# Altium project PCB_Project1.PrjPCB
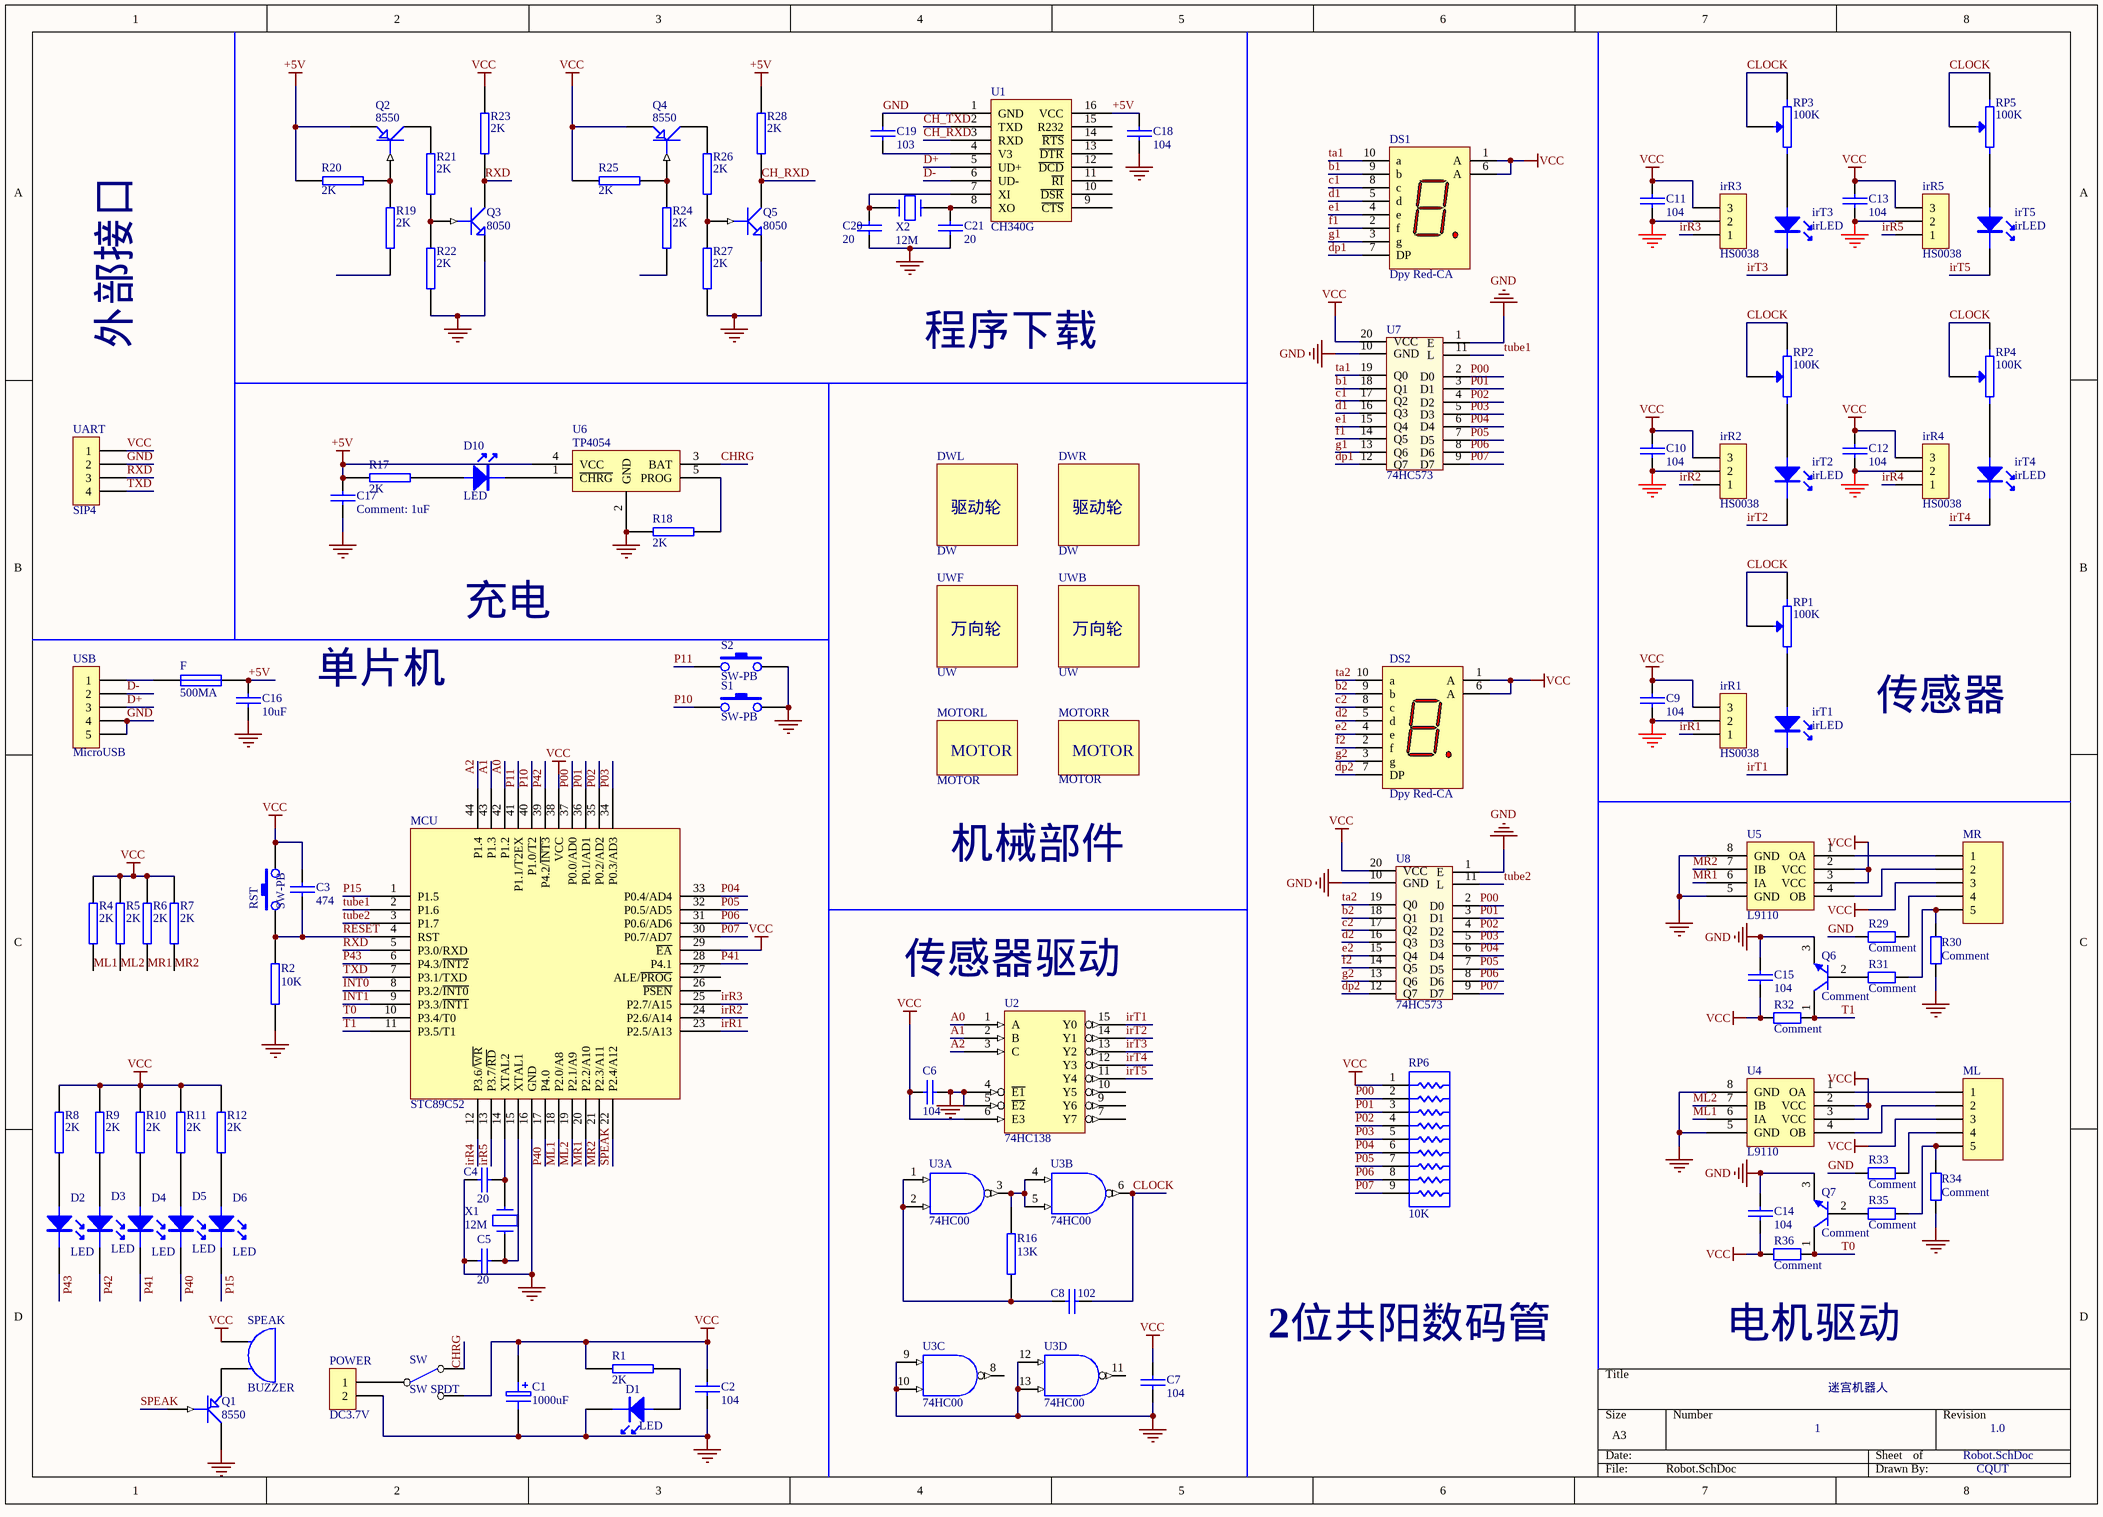
[diagram p0: Robot.SchDoc]
1 sheet, 113 parts. Net scope: global (net labels, ports and power ports of the same name join across sheets).
Board file: Robot.PcbDoc

## Sheet Robot.SchDoc: 迷宫机器人
size A3; Organization: CQUT; Address1: 中国重庆市巴南区红光大道69号重庆理工大学; DocumentNumber: 1; Revision: 1.0; SheetNumber: 1; SheetTotal: 1

### Parts
C1  1000uF  [RB.1/.3]
C2  104  [0805C]
C3  474  [0805C]
C4  20  [0805C]
C5  20  [0805C]
C6  104  [0805C]
C7  104  [0805C]
C8  102  [0805C]
C9  104  [0805C]
C10  104  [0805C]
C11  104  [0805C]
C12  104  [0805C]
C13  104  [0805C]
C14  104  [0805C]
C15  104  [0805C]
C16  10uF  [0805C]
C17  1uF  [0805C]
C18  104  [0805C]
C19  103  [0805C]
C20  20  [0805C]
C21  20  [0805C]
D1  LED  [0805D]
D2  LED  [0805D]
D3  LED  [0805D]
D4  LED  [0805D]
D5  LED  [0805D]
D6  LED  [0805D]
D10  LED  [0805D]
DS1  Dpy Red-CA  [A]
DS2  Dpy Red-CA  [A]
DWL  DW  [DW]
DWR  DW  [DW]
F  500MA  [0805R]
irR1  HS0038  [SIP3]
irR2  HS0038  [SIP3]
irR3  HS0038  [SIP3]
irR4  HS0038  [SIP3]
irR5  HS0038  [SIP3]
irT1  irLED  [LED-5-TOP]
irT2  irLED  [LED-5-TOP]
irT3  irLED  [LED-5-TOP]
irT4  irLED  [LED-5-TOP]
irT5  irLED  [LED-5-TOP]
MCU  STC89C52  [TQFP-44]
ML  Comment  (value not drawn)
MOTORL  MOTOR  [MOTOR]
MOTORR  MOTOR  [MOTOR]
MR  Comment  (value not drawn)
POWER  DC3.7V  [XH2.54-2P]
Q1  8550  [SOT-23-P]
Q2  8550  [SOT-23-P]
Q3  8050  [SOT-23-N]
Q4  8550  [SOT-23-P]
Q5  8050  [SOT-23-N]
Q6  Comment
Q7  Comment
R1  2K  [0805R]
R2  10K  [0805R]
R4  2K  [0805R]
R5  2K  [0805R]
R6  2K  [0805R]
R7  2K  [0805R]
R8  2K  [0805R]
R9  2K  [0805R]
R10  2K  [0805R]
R11  2K  [0805R]
R12  2K  [0805R]
R16  13K  [0805R]
R17  2K  [0805R]
R18  2K  [0805R]
R19  2K  [0805R]
R20  2K  [0805R]
R21  2K  [0805R]
R22  2K  [0805R]
R23  2K  [0805R]
R24  2K  [0805R]
R25  2K  [0805R]
R26  2K  [0805R]
R27  2K  [0805R]
R28  2K  [0805R]
R29  Comment  [0805R]
R30  Comment  [0805R]
R31  Comment  [0805R]
R32  Comment  [0805R]
R33  Comment  [0805R]
R34  Comment  [0805R]
R35  Comment  [0805R]
R36  Comment  [0805R]
RP1  100K  [VR-5]
RP2  100K  [VR-5]
RP3  100K  [VR-5]
RP4  100K  [VR-5]
RP5  100K  [VR-5]
RP6  10K  [SIP9 - duplicate]
RST  SW-PB  [SWITCH]
S1  SW-PB  [SWITCH]
S2  SW-PB  [SWITCH]
SPEAK  BUZZER  [BUZZ]
SW  SW SPDT  [SW-1-2]
U1  CH340G  [SOP-16]
U2  74HC138  [SOP-16]
U3  74HC00  [SO-14]  (parts A,B,C,D of 4)
U4  L9110  [SO-8]
U5  L9110  [SO-8]
U6  TP4054  [SOT-23-5]
U7  74HC573  [SOP-20（1.27）]
U8  74HC573  [SOP-20（1.27）]
UART  SIP4  [SIP4]
USB  MicroUSB  [MircoUSB]
UWB  UW  [UW]
UWF  UW  [UW]
X1  12M  [XTAL2]
X2  12M  [XTAL2]

### Nets
+5V: C16.1 C17.1 C18.1 F.2 Q2.2(E) R17.1 R20.1 R28.1 U1.16(VCC) U6.4(VCC)
GND: C1.2 C2.2 C4.2 C5.2 C6.1 C7.2 C9.2 C10.2 C11.2 C12.2 C13.2 C14.2 C15.2 C16.2 C17.2 C18.2 C19.1 C20.2 C21.2 D1.2 irR1.2 irR2.2 irR3.2 irR4.2 irR5.2 MCU.16(GND) POWER.2 Q1.3(C) Q3.3(E) Q5.3(E) Q6.3(E) Q7.3(E) R2.1 R18.1 R22.2 R27.2 R29.2 R30.1 R33.2 R34.1 S1.2 S2.2 U1.1(GND) U2.4(~{E1}) U2.5(~{E2}) U2.8(GND) U3.7(GND) U3.9(A) U3.10(B) U3.12(A) U3.13(B) U4.5(GND) U4.8(GND) U5.5(GND) U5.8(GND) U6.2(GND) U7.1(E) U7.10(GND) U8.1(E) U8.10(GND) UART.2 USB.4 USB.5
VCC: C1.1 C2.1 C3.1 C6.2 C7.1 C9.1 C10.1 C11.1 C12.1 C13.1 C14.1 C15.1 DS1.1(A) DS1.6(A) DS2.1(A) DS2.6(A) irR1.3 irR2.3 irR3.3 irR4.3 irR5.3 MCU.29(~{EA}) MCU.38(VCC) ML.3 MR.3 Q4.2(E) R1.1 R4.1 R5.1 R6.1 R7.1 R8.1 R9.1 R10.1 R11.1 R12.1 R23.1 R25.1 R32.1 R36.1 RP6.1 RST.2 SPEAK.1(A) SW.3(NO) U2.6(E3) U2.16(VCC) U3.14(VCC) U4.2(VCC) U4.3(VCC) U5.2(VCC) U5.3(VCC) U7.20(VCC) U8.20(VCC) UART.1
A0: MCU.42(P1.2) U2.1(A)
A1: MCU.43(P1.3) U2.2(B)
A2: MCU.44(P1.4) U2.3(C)
b1: DS1.9(b) U7.18(Q1)
b2: DS2.9(b) U8.18(Q1)
c1: DS1.8(c) U7.17(Q2)
c2: DS2.8(c) U8.17(Q2)
CH_RXD: Q5.2(C) R28.2 U1.3(RXD)
CH_TXD: U1.2(TXD)
CHRG: SW.2(NC) U6.3(BAT)
CLOCK: C8.1 RP1.1 RP1.2(W) RP2.1 RP2.2(W) RP3.1 RP3.2(W) RP4.1 RP4.2(W) RP5.1 RP5.2(W) U3.6(Y)
d1: DS1.5(d) U7.16(Q3)
d2: DS2.5(d) U8.16(Q3)
D+: U1.5(UD+) USB.3
D-: U1.6(UD-) USB.2
dp1: DS1.7(DP) U7.12(Q7)
dp2: DS2.7(DP) U8.12(Q7)
e1: DS1.4(e) U7.15(Q4)
e2: DS2.4(e) U8.15(Q4)
f1: DS1.2(f) U7.14(Q5)
f2: DS2.2(f) U8.14(Q5)
g1: DS1.3(g) U7.13(Q6)
g2: DS2.3(g) U8.13(Q6)
INT0: MCU.8(P3.2/~{INT0})
INT1: MCU.9(P3.3/~{INT1})
irR1: irR1.1 MCU.23(P2.5/A13)
irR2: irR2.1 MCU.24(P2.6/A14)
irR3: irR3.1 MCU.25(P2.7/A15)
irR4: irR4.1 MCU.12(P3.6/~{WR})
irR5: irR5.1 MCU.13(P3.7/~{RD})
irT1: irT1.2 U2.15(Y0)
irT2: irT2.2 U2.14(Y1)
irT3: irT3.2 U2.13(Y2)
irT4: irT4.2 U2.12(Y3)
irT5: irT5.2 U2.11(Y4)
ML1: MCU.18(P2.0/A8) R4.2 U4.6(IA)
ML2: MCU.19(P2.1/A9) R5.2 U4.7(IB)
MR1: MCU.20(P2.2/A10) R6.2 U5.6(IA)
MR2: MCU.21(P2.3/A11) R7.2 U5.7(IB)
P00: MCU.37(P0.0/AD0) RP6.2 U7.2(D0) U8.2(D0)
P01: MCU.36(P0.1/AD1) RP6.3 U7.3(D1) U8.3(D1)
P02: MCU.35(P0.2/AD2) RP6.4 U7.4(D2) U8.4(D2)
P03: MCU.34(P0.3/AD3) RP6.5 U7.5(D3) U8.5(D3)
P04: MCU.33(P0.4/AD4) RP6.6 U7.6(D4) U8.6(D4)
P05: MCU.32(P0.5/AD5) RP6.7 U7.7(D5) U8.7(D5)
P06: MCU.31(P0.6/AD6) RP6.8 U7.8(D6) U8.8(D6)
P07: MCU.30(P0.7/AD7) RP6.9 U7.9(D7) U8.9(D7)
P10: MCU.40(P1.0/T2) S1.1
P11: MCU.41(P1.1/T2EX) S2.1
P15: D6.2 MCU.1(P1.5)
P40: D5.2 MCU.17(P4.0)
P41: D4.2 MCU.28(P4.1)
P42: D3.2 MCU.39(P4.2/~{INT3})
P43: D2.2 MCU.6(P4.3/~{INT2})
RESET: C3.2 MCU.4(RST) R2.2 RST.1
RXD: MCU.5(P3.0/RXD) Q3.2(C) R23.2 UART.3
SPEAK: MCU.22(P2.4/A12) Q1.1(B)
T0: MCU.10(P3.4/T0) Q7.1(C) R36.2
T1: MCU.11(P3.5/T1) Q6.1(C) R32.2
ta1: DS1.10(a) U7.19(Q0)
ta2: DS2.10(a) U8.19(Q0)
tube1: MCU.2(P1.6) U7.11(L)
tube2: MCU.3(P1.7) U8.11(L)
TXD: MCU.7(P3.1/TXD) UART.4
NetC4_1: C4.1 MCU.14(XTAL2) X1.2
NetC5_1: C5.1 MCU.15(XTAL1) X1.1
NetC8_2: C8.2 R16.1 U3.1(A) U3.2(B)
NetC19_2: C19.2 U1.4(V3)
NetC20_1: C20.1 U1.7(XI) X2.1
NetC21_1: C21.1 U1.8(XO) X2.2
NetD1_1: D1.1 R1.2
NetD2_1: D2.1 R8.2
NetD3_1: D3.1 R9.2
NetD4_1: D4.1 R10.2
NetD5_1: D5.1 R11.2
NetD6_1: D6.1 R12.2
NetD10_1: D10.1 R17.2
NetD10_2: D10.2 U6.1(~{CHRG})
NetF_1: F.1 USB.1
NetirT1_1: irT1.1 RP1.3
NetirT2_1: irT2.1 RP2.3
NetirT3_1: irT3.1 RP3.3
NetirT4_1: irT4.1 RP4.3
NetirT5_1: irT5.1 RP5.3
NetML_1: ML.1 U4.1(OA)
NetML_2: ML.2 U4.4(OB)
NetML_4: ML.4 R33.1
NetML_5: ML.5 R34.2 R35.1
NetMR_1: MR.1 U5.1(OA)
NetMR_2: MR.2 U5.4(OB)
NetMR_4: MR.4 R29.1
NetMR_5: MR.5 R30.2 R31.1
NetPOWER_1: POWER.1 SW.1(COMMON)
NetQ1_2: Q1.2(E) SPEAK.2(B)
NetQ2_1: Q2.1(B) R19.1 R20.2
NetQ2_3: Q2.3(C) R21.1
NetQ3_1: Q3.1(B) R21.2 R22.1
NetQ4_1: Q4.1(B) R24.1 R25.2
NetQ4_3: Q4.3(C) R26.1
NetQ5_1: Q5.1(B) R26.2 R27.1
NetQ6_2: Q6.2(B) R31.2
NetQ7_2: Q7.2(B) R35.2
NetR16_2: R16.2 U3.3(Y) U3.4(A) U3.5(B)
NetR18_2: R18.2 U6.5(PROG)

Not connected (* = marked no-connect by the designer): MCU 26(~{PSEN}) 27(ALE/~{PROG}); R19 2; R24 2; U1 9(~{CTS}) 10(~{DSR}) 11(~{RI}) 12(~{DCD}) 13(~{DTR}) 14(~{RTS}) 15(R232); U2 7(Y7) 9(Y6) 10(Y5); U3 8(Y) 11(Y)

### Notes on the sheet
- 外部接口
- 程序下载
- 充电
- 单片机
- 传感器
- 机械部件
- (near U2) 传感器驱动
- (near R36) 电机驱动
- Labels drawn without touching a wire or pin: 2位共阳数码管
- (in symbol DW) 驱动轮
- (in symbol UW) 万向轮

### Library data of the parts
C1 = ELECTRO1: Electrolytic Capacitor
C2-C21 = CAP: Capacitor
DS1 DS2 = Dpy Red-CA: 7.62 mm Black Surface HER 7-Segment Display: CA, RH DP; MinimumIntensity: 360 ucd; Note: IF = 5 mA; Colour: High Efficiency Red (HER); Note: Pins 1 and 6 are redundant Anodes.; Published: 8-Jun-2000; LatestRevisionDate: 17-Dec-2003; LatestRevisionNote: Schematic revised, PCB Footprint replaced.; DatasheetVersion: 19-Feb-2002; PackageVersion: 11-Feb-2002; PackageReference: A; Publisher: Altium Limited; PackageDescription: LED, 7-Segment Display, 7.62 mm, RHD; 10 Leads; Row Space 5.08 mm; Pitch 2.54 mm; ComponentLink1Description: Manufacturer Link; ComponentLink1URL: http://www.agilent.com/
DWL DWR = DW: driving wheel
F = FUSE1: Fuse
irR1-irR5 = CON3: Connector
irT1-irT5 = LED
MCU = STC89C52RC-PQFP: MCU
ML MR = Header 5: 5PIN
POWER = CON2: Connector
Q1 Q2 Q4 = PNP1: PNP Transistor
Q3 Q5 = NPN1: NPN Transistor
Q6 Q7 = QNPN: NPN三极管; Name: *
R1 R2 R4-R12 R16-R28 = RES2
R29-R36 = Res2: 电阻; Value: *
RP1-RP5 = POT2: Potentiometer
RP6 = Res Pack2: 9PIN排阻; Value: *
U1 = CH340G: USB-SERIAL
U2 = 74ALS138
U3 = 74HC00: Quad 2-Input Positive-NAND Gate
UART = CON4: Connector
USB = CON5: Connector
UWB UWF = UW: universal wheel
X1 X2 = CRYSTAL